# EAGLE design CEAZA SNOW SCALE V1.3 (EAGLE 9.6.2)
CEAZA
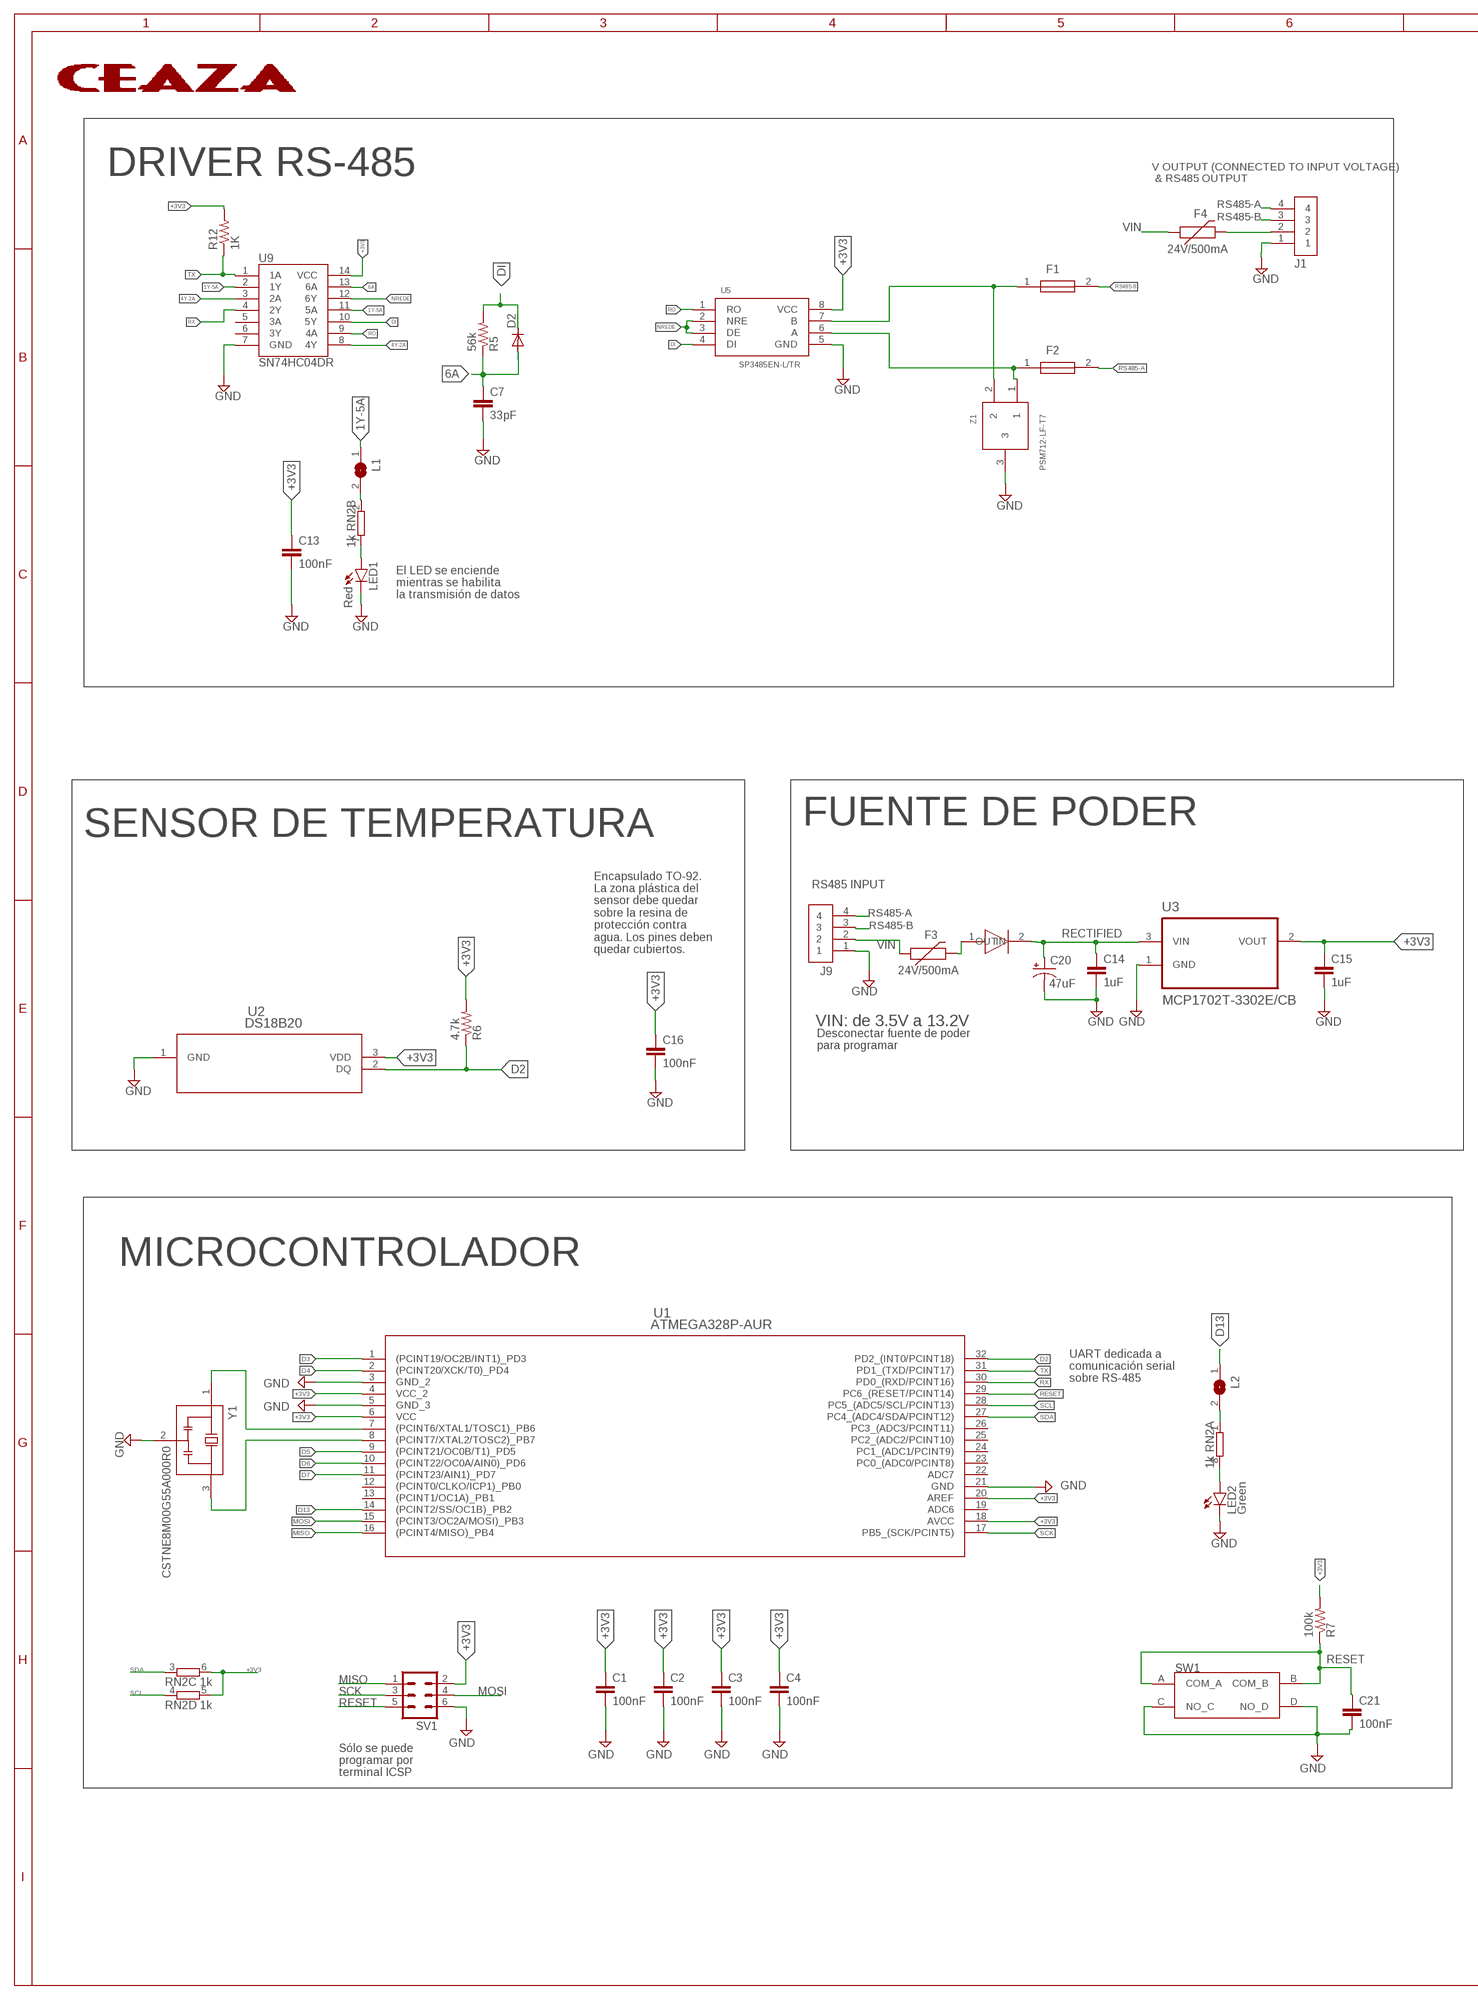
[diagram p0: schematic, sheet 1, part 1 of 2]
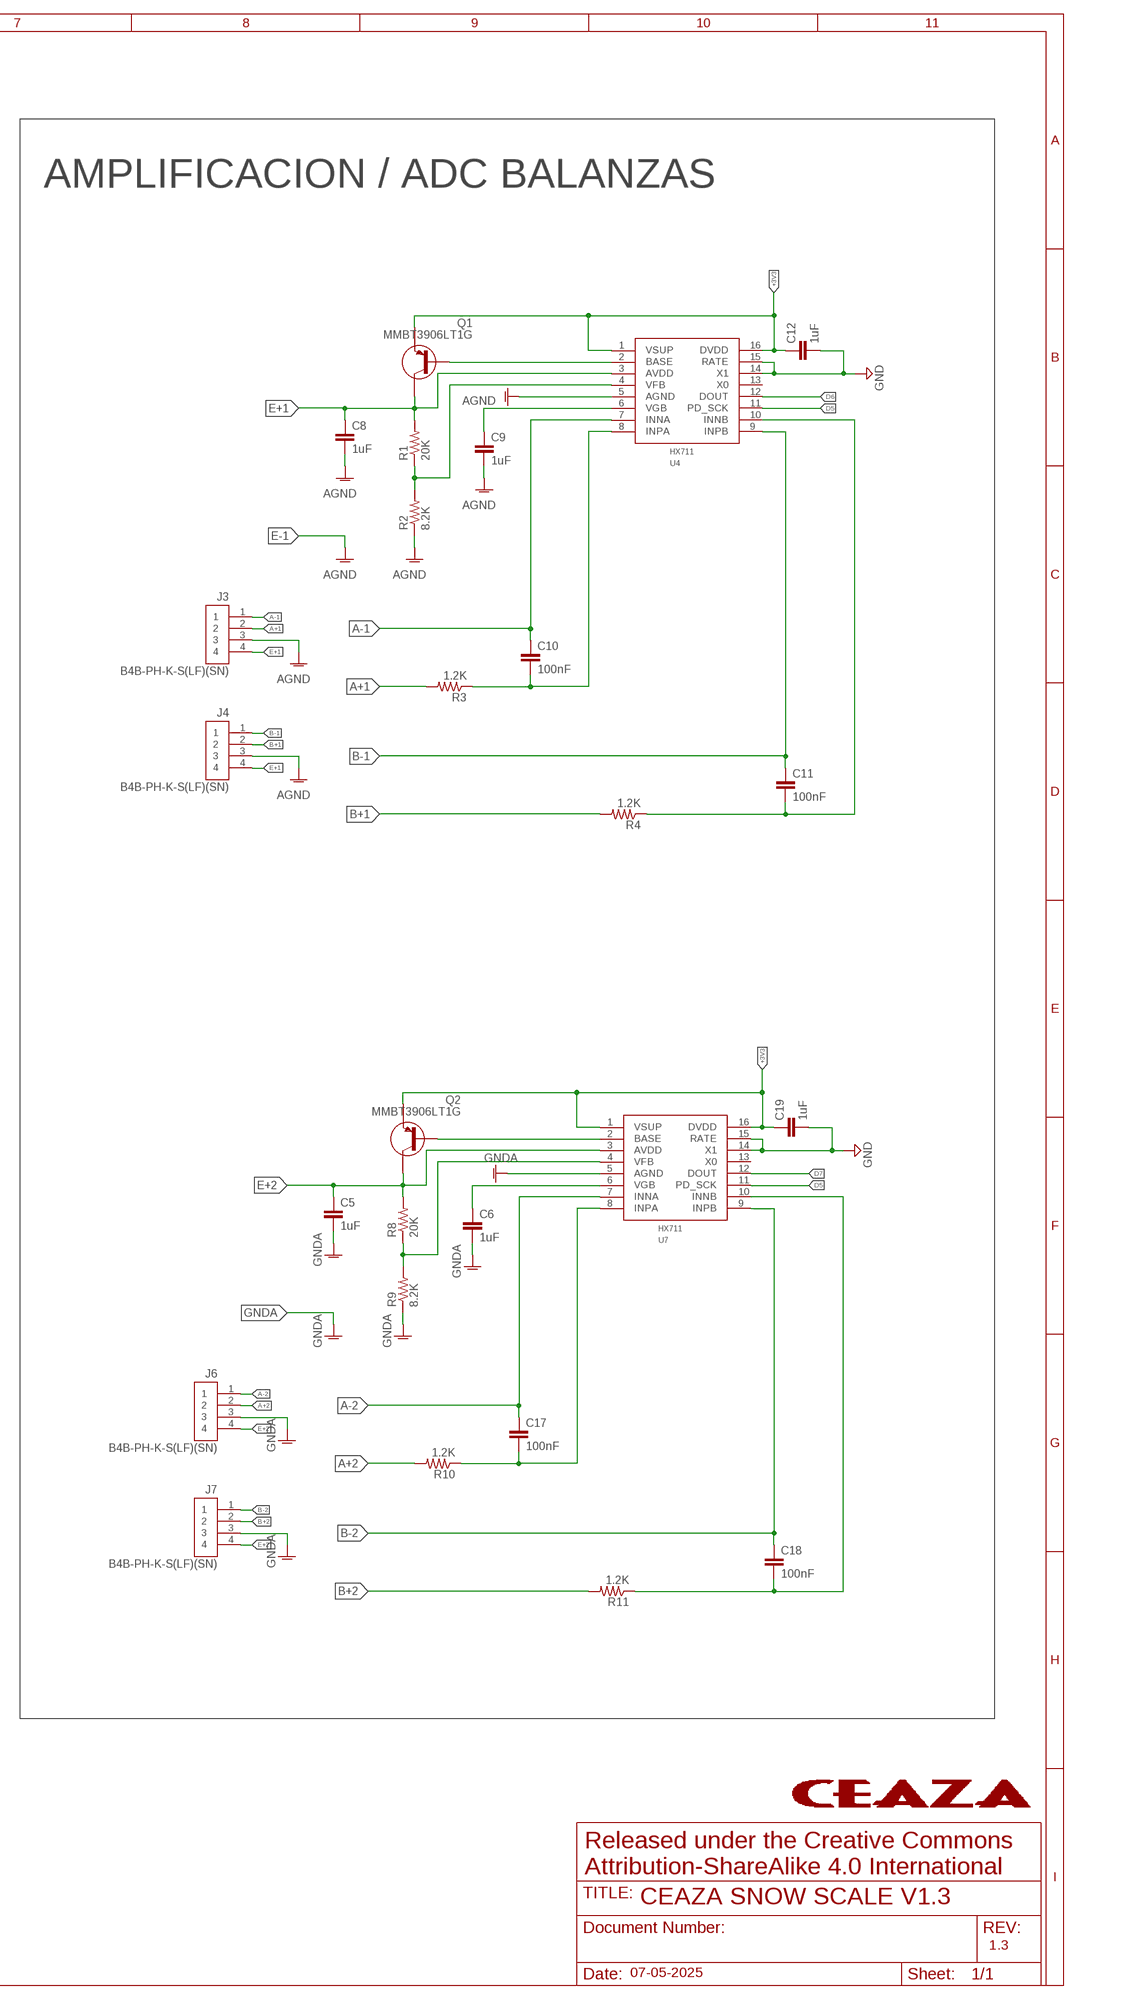
[diagram p1: schematic, sheet 1, part 2 of 2]

## Parts
C1  100nF  C-EUC0603K  [C0603K]
C2  100nF  C-EUC0603K  [C0603K]
C3  100nF  C-EUC0603K  [C0603K]
C4  100nF  C-EUC0603K  [C0603K]
C5  1uF  C-EUC0603K  [C0603K]
C6  1uF  C-EUC0603K  [C0603K]
C7  33pF  C-EUC0603K  [C0603K]
C8  1uF  C-EUC0603K  [C0603K]
C9  1uF  C-EUC0603K  [C0603K]
C10  100nF  C-EUC0603K  [C0603K]
C11  100nF  C-EUC0603K  [C0603K]
C12  1uF  C-EUC0603K  [C0603K]
C13  100nF  C-EUC0603K  [C0603K]
C14  1uF  C-EUC0603K  [C0603K]
C15  1uF  C-EUC0603K  [C0603K]
C16  100nF  C-EUC0603K  [C0603K]
C17  100nF  C-EUC0603K  [C0603K]
C18  100nF  C-EUC0603K  [C0603K]
C19  1uF  C-EUC0603K  [C0603K]
C20  47uF  CPOL-US153CLV-0605  [153CLV-0605]
C21  100nF  C-EUC0603K  [C0603K]
D1  SMA-SS34  [SMA-SS34]
D2  DIODE-SOD323-R  [SOD323-R]
F1  0805L010_24YR  [FUSC2114X100N]
F2  0805L010_24YR  [FUSC2114X100N]
F3  24V/500mA  PPTC_16V_2.5A  [1812]
F4  24V/500mA  PPTC_16V_2.5A  [1812]
J1  B4B-PH-K-S(LF)(SN)  [JST_B4B-PH-K-S(LF)(SN)]
J3  B4B-PH-K-S(LF)(SN)  [JST_B4B-PH-K-S(LF)(SN)]
J4  B4B-PH-K-S(LF)(SN)  [JST_B4B-PH-K-S(LF)(SN)]
J6  B4B-PH-K-S(LF)(SN)  [JST_B4B-PH-K-S(LF)(SN)]
J7  B4B-PH-K-S(LF)(SN)  [JST_B4B-PH-K-S(LF)(SN)]
J9  B4B-PH-K-S(LF)(SN)  [JST_B4B-PH-K-S(LF)(SN)]
L1  SJ  [SJ]
L2  SJ  [SJ]
LED1  Red  LEDCHIP-LED0805  [CHIP-LED0805]
LED2  Green  LEDCHIP-LED0805  [CHIP-LED0805]
Q1  MMBT3906LT1G  [SOT23]
Q2  MMBT3906LT1G  [SOT23]
R1  20K  R-US_R0603  [R0603]
R2  8.2K  R-US_R0603  [R0603]
R3  1.2K  R-US_R0603  [R0603]
R4  1.2K  R-US_R0603  [R0603]
R5  56k  R-US_R0603  [R0603]
R6  4.7k  R-US_R0603  [R0603]
R7  100k  R-US_R0603  [R0603]
R8  20K  R-US_R0603  [R0603]
R9  8.2K  R-US_R0603  [R0603]
R10  1.2K  R-US_R0603  [R0603]
R11  1.2K  R-US_R0603  [R0603]
R12  1K  R-US_R0603  [R0603]
RN2  1k  4R-N0603-ARV  [0603-ARV]
SV1  MA03-2  [MA03-2]
SW1  SW_KH-6X6X5H-STM  [SW_KH-6X6X5H-STM]
U1  ATMEGA328P-AUR  [32A]
U2  DS18B20  [21-0248A_MXM]
U3  MCP1702T-3302E/CB  [SOT95P255X145-3N]
U4  HX711  [HX711]
U5  SP3485EN-L/TR  [SP3485EN-L/TR]
U7  HX711  [HX711]
U9  SN74HC04DR  [SOIC127P600X175-14N]
Y1  CSTNE8M00G55A000R0  [OSC_CSTNE8M00G55A000R0]
Z1  PSM712-LF-T7  [SOT23]

## Nets
1Y-5A: L1.1 U9.2(1Y) U9.11(5A)
4Y-2A: U9.3(2A) U9.8(4Y)
6A: C7.1 D2.A R5.1 U9.13(6A)
+3V3: C1.1 C2.1 C3.1 C4.1 C12.1 C13.1 C15.1 C16.1 C19.1 Q1.2(E) Q2.2(E) R6.2 R7.2 R12.2 RN2.5 RN2.6 SV1.2 U1.4(VCC_2) U1.6(VCC) U1.18(AVCC) U1.20(AREF) U2.3(VDD) U3.2(VOUT) U4.1(VSUP) U4.16(DVDD) U5.8(VCC) U7.1(VSUP) U7.16(DVDD) U9.14(VCC)
A+1: J3.2 R3.2
A+2: J6.2 R10.2
A-1: C10.1 J3.1 U4.7(INNA)
A-2: C17.1 J6.1 U7.7(INNA)
AGND: C8.2 C9.2 J3.3 J4.3 R2.1 U4.5(AGND)
B+1: J4.2 R4.2
B+2: J7.2 R11.2
B-1: C11.1 J4.1 U4.9(INPB)
B-2: C18.1 J7.1 U7.9(INPB)
D2: R6.1 U1.32(PD2_(INT0/PCINT18)) U2.2(DQ)
D3: U1.1((PCINT19/OC2B/INT1)_PD3)
D4: U1.2((PCINT20/XCK/T0)_PD4)
D5: U1.9((PCINT21/OC0B/T1)_PD5) U4.11(PD_SCK) U7.11(PD_SCK)
D6: U1.10((PCINT22/OC0A/AIN0)_PD6) U4.12(DOUT)
D7: U1.11((PCINT23/AIN1)_PD7) U7.12(DOUT)
D13: L2.1 U1.14((PCINT2/SS/OC1B)_PB2)
DI: D2.C R5.2 U5.4(DI) U9.10(5Y)
E+1: C8.1 J3.4 J4.4 Q1.3(C) R1.2 U4.3(AVDD)
E+2: C5.1 J6.4 J7.4 Q2.3(C) R8.2 U7.3(AVDD)
GND: C1.2 C2.2 C3.2 C4.2 C7.2 C12.2 C13.2 C14.2 C15.2 C16.2 C19.2 C20.- C21.2 J1.1 J9.1 LED1.C LED2.C SV1.6 SW1.C(NO_C) SW1.D(NO_D) U1.3(GND_2) U1.5(GND_3) U1.21(GND) U2.1(GND) U3.1(GND) U4.14(X1) U4.15(RATE) U5.5(GND) U7.14(X1) U7.15(RATE) U9.7(GND) Y1.2(GND) Z1.3
GNDA: C5.2 C6.2 J6.3 J7.3 R9.1 U7.5(AGND)
MISO: SV1.1 U1.16((PCINT4/MISO)_PB4)
MOSI: SV1.4 U1.15((PCINT3/OC2A/MOSI)_PB3)
N$1: F2.1 U5.6(A) Z1.1
N$2: Q1.1(B) U4.2(BASE)
N$3: LED1.A RN2.7
N$4: C9.1 U4.6(VGB)
N$5: R1.1 R2.2 U4.4(VFB)
N$6: Q2.1(B) U7.2(BASE)
N$7: C10.2 R3.1 U4.8(INPA)
N$8: C11.2 R4.1 U4.10(INNB)
N$9: R8.1 R9.2 U7.4(VFB)
N$10: U1.7((PCINT6/XTAL1/TOSC1)_PB6) Y1.1(IN)
N$11: U1.8((PCINT7/XTAL2/TOSC2)_PB7) Y1.3(OUT)
N$12: LED2.A RN2.8
N$13: C6.1 U7.6(VGB)
N$14: C17.2 R10.1 U7.8(INPA)
N$15: C18.2 R11.1 U7.10(INNB)
N$16: F1.1 U5.7(B) Z1.2
N$17: F4.2 J1.2
N$18: D1.1(IN) F3.2
N$19: L1.2 RN2.2
N$20: L2.2 RN2.1
NREDE: U5.2(NRE) U5.3(DE) U9.12(6Y)
RECTIFIED: C14.1 C20.+ D1.2(OUT) U3.3(VIN)
RESET: C21.1 R7.1 SV1.5 SW1.A(COM_A) SW1.B(COM_B) U1.29(PC6_(RESET/PCINT14))
RO: U5.1(RO) U9.9(4A)
RS485-A: F2.2 J1.4 J9.4
RS485-B: F1.2 J1.3 J9.3
RX: U1.30(PD0_(RXD/PCINT16)) U9.4(2Y)
SCK: SV1.3 U1.17(PB5_(SCK/PCINT5))
SCL: RN2.4 U1.28(PC5_(ADC5/SCL/PCINT13))
SDA: RN2.3 U1.27(PC4_(ADC4/SDA/PCINT12))
TX: R12.1 U1.31(PD1_(TXD/PCINT17)) U9.1(1A)
VIN: F3.1 F4.1 J9.2
Unconnected: U1.12((PCINT0/CLKO/ICP1)_PB0) U1.13((PCINT1/OC1A)_PB1) U1.19(ADC6) U1.22(ADC7) U1.23(PC0_(ADC0/PCINT8)) U1.24(PC1_(ADC1/PCINT9)) U1.25(PC2_(ADC2/PCINT10)) U1.26(PC3_(ADC3/PCINT11)) U4.13(X0) U7.13(X0) U9.5(3A) U9.6(3Y)

## Notes on the sheet
- DRIVER RS-485
- V OUTPUT (CONNECTED TO INPUT VOLTAGE)
   & RS485 OUTPUT
- AMPLIFICACION / ADC BALANZAS
- El LED se enciende
  mientras se habilita
  la transmisión de datos
- SENSOR DE TEMPERATURA | FUENTE DE PODER
- RS485 INPUT
- Encapsulado TO-92. 
  La zona plástica del 
  sensor debe quedar 
  sobre la resina de 
  protección contra 
  agua. Los pines deben
  quedar cubiertos.
- VIN: de 3.5V a 13.2V
- Desconectar fuente de poder
  para programar
- MICROCONTROLADOR
- UART dedicada a
  comunicación serial
  sobre RS-485
- Sólo se puede 
  programar por
  terminal ICSP
- Released under the Creative Commons
  Attribution-ShareAlike 4.0 International
- 1.3
- 07-05-2025
- C:/Users/adria/OneDrive/Imágenes/CEAZA_NOMBRE_COLOR.bmp

## Library data of the parts
C1-C19 C21 = rcl:C-EU: CAPACITOR, European symbol; SPICEPREFIX: C
C20 = rcl:CPOL-US: POLARIZED CAPACITOR, American symbol; SPICEPREFIX: C
D1 = SMA-SS34:SMA-SS34
D2 = diode:DIODE-: DIODE
F1 F2 = 0805L010_24YR:0805L010_24YR: LITTELFUSE - 0805L010/24YR - Resettable Fuse, PPTC, 0805 (2012 Metric), POLY-FUSE 0805L Series, 24 VDC, 100 mA, 300 mA, 1.5 s Source: Datasheet <https://4donline.ihs.com/images/VipMasterIC/IC/LFSI/LFSI-S-A0008594415/LFSI-S-A0008594415-1.pdf?hkey=6D3A4C79FDBF58556ACFDE234799DDF0>; DESCRIPTION: LITTELFUSE - 0805L010/24YR - Resettable Fuse, PPTC, 0805 (2012 Metric), POLY-FUSE 0805L Series, 24 VDC, 100 mA, 300 mA, 1.5 s; HEIGHT: 1mm; MANUFACTURER_NAME: LITTELFUSE; MANUFACTURER_PART_NUMBER: 0805L010/24YR; MOUSER_PART_NUMBER: 576-0805L010/24YR; MOUSER_PRICE-STOCK: https://www.mouser.co.uk/ProductDetail/Littelfuse/0805L010-24YR?qs=cIziFXvMxOWw%2F8NcVv01xw%3D%3D
F3 F4 = SparkFun-Fuses:PPTC: Resettable Fuse PPTC Resettable Fuse. Really a sort of resistor with a polymeric positive temperature coefficient whose resistance increases dramatically with an increase in temperature. When heated by the power passing through the resistance rises causing the current to be limited, protecting the circuit. This is achieved by the transition of the polymer from a crystalline to an amorphous state where the conductive carbon separates breaking the conductive pathways found in the cool crystalline structure. When a PPTC cools back down it resumes conducting letting the circuit turn back on. SparkFun Products: SparkFun RedBoard - Programmed with Arduino <https://www.sparkfun.com/products/12757> Pro Micro - 5V/16MHz <https://www.sparkfun.com/products/12640> Arduino Pro 328 - 5V/16MHz <https://www.sparkfun.com/products/10915> MP3 Trigger <https://www.sparkfun.com/products/13720>; PROD_ID: RES-14390; VALUE: 16V/2.5A(5A TRIP)
J1 J3 J4 J6 J7 J9 = B4B-PH-K-S_LF__SN_:B4B-PH-K-S(LF)(SN): PH Series 4 Position 2 mm Pitch Through Hole Crimp Top Entry Shrouded Header; ARROW_ELECTRONICS-PURCHASE-URL: https://snapeda.com/shop?store=Arrow+Electronics&id=422410; AVAILABILITY: Unavailable; DESCRIPTION: Connector Header Through Hole 4 position 0.079 (2.00mm); MF: JST Sales; MP: B4B-PH-K-S(LF)(SN); PACKAGE: None; PRICE: None
L1 L2 = jumper:SJ: SMD solder JUMPER
LED1 LED2 = led:LED: LED OSRAM: - CHIPLED LG R971, LG N971, LY N971, LG Q971, LY Q971, LO R971, LY R971 LH N974, LH R974 LS Q976, LO Q976, LY Q976 LO Q996 - Hyper CHIPLED LW Q18S LB Q993, LB Q99A, LB R99A - SideLED LS A670, LO A670, LY A670, LG A670, LP A670 LB A673, LV A673, LT A673, LW A673 LH A674 LY A675 LS A676, LA A676, LO A676, LY A676, LW A676 LS A679, LY A679, LG A679 - Hyper Micro SIDELED® LS Y876, LA Y876, LO Y876, LY Y876 LT Y87S - SmartLED LW L88C, LW L88S LB L89C, LB L89S, LG L890 LS L89K, LO L89K, LY L89K LS L896, LA L896, LO L896, LY L896 - TOPLED LS T670, LO T670, LY T670, LG T670, LP T670 LSG T670, LSP T670, LSY T670, LOP T670, LYG T670 LG T671, LOG T671, LSG T671 LB T673, LV T673, LT T673, LW T673 LH T674 LS T676, LA T676, LO T676, LY T676, LB T676, LH T676, LSB T676, LW T676 LB T67C, LV T67C, LT T67C, LS T67K, LO T67K, LY T67K, LW E67C LS E67B, LA E67B, LO E67B, LY E67B, LB E67C, LV E67C, LT E67C LW T67C LS T679, LY T679, LG T679 LS T770, LO T770, LY T770, LG T770, LP T770 LB T773, LV T773, LT T773, LW T773 LH T774 LS E675, LA E675, LY E675, LS T675 LS T776, LA T776, LO T776, LY T776, LB T776 LHGB T686 LT T68C, LB T68C - Hyper Mini TOPLED® LB M676 - Mini TOPLED Santana® LG M470 LS M47K, LO M47K, LY M47K Source: http://www.osram.convergy.de LUXEON: - LUMILED® LXK2-PW12-R00, LXK2-PW12-S00, LXK2-PW14-U00, LXK2-PW14-V00 LXK2-PM12-R00, LXK2-PM12-S00, LXK2-PM14-U00 LXK2-PE12-Q00, LXK2-PE12-R00, LXK2-PE12-S00, LXK2-PE14-T00, LXK2-PE14-U00 LXK2-PB12-K00, LXK2-PB12-L00, LXK2-PB12-M00, LXK2-PB14-N00, LXK2-PB14-P00, LXK2-PB14-Q00 LXK2-PR12-L00, LXK2-PR12-M00, LXK2-PR14-Q00, LXK2-PR14-R00 LXK2-PD12-Q00, LXK2-PD12-R00, LXK2-PD12-S00 LXK2-PH12-R00, LXK2-PH12-S00 LXK2-PL12-P00, LXK2-PL12-Q00, LXK2-PL12-R00 Source: www.luxeon.com KINGBRIGHT: KA-3528ASYC Source: www.kingbright.com
Q1 Q2 = MMBT3906LT1G:MMBT3906LT1G: http://octopart.com/mmbt3906lt1g.-on+semiconductor-8986246; AVAILABILITY: Unavailable; DESCRIPTION: Bipolar _BJT_ Transistor PNP 40V 200mA 250MHz 300mW Surface Mount SOT-23-3 _TO-236_; MF: ON Semiconductor; MP: MMBT3906LT1G; PACKAGE: SOT-23-3 Motorola; PRICE: None
R1-R12 = rcl:R-US_: RESISTOR, American symbol; SPICEPREFIX: R
RN2 = resistor-dil:4R-N: Array Chip Resistor Source: RS Component / Phycomp; OC_FARNELL: unknown; OC_NEWARK: unknown
SV1 = con-lstb:MA03-2: PIN HEADER; OC_FARNELL: unknown; OC_NEWARK: unknown
SW1 = SW_KH-6X6X5H-STM:SW_KH-6X6X5H-STM
U1 = ATMEGA328P-AUR:ATMEGA328P-AUR; BUILT_BY: EMA_UL_Team; MANUFACTURER_PART_NUMBER: ATMEGA328P-AUR; VENDOR: Atmel
U2 = DS18B20:DS18B20; BUILT_BY: EMA_UL_Team; MANUFACTURER_PART_NUMBER: DS18B20; SOURCELIBRARY: Maxim_2011-05-13; VENDOR: Maxim Integrated Products
U3 = MCP1702T-3302E_CB:MCP1702T-3302E/CB: 250 mA Low Quiescent Current LDO Regulator Check prices <https://snapeda.com/parts/MCP1702T-3302E/CB/Microchip/view-part/?ref=eda>; ARROW_ELECTRONICS-PURCHASE-URL: https://snapeda.com/shop?store=Arrow+Electronics&id=44686; AVAILABILITY: Good; DESCRIPTION: Linear Voltage Regulator IC 1 Output 250mA SOT-23A-3; DIGIKEY-PURCHASE-URL: https://snapeda.com/shop?store=DigiKey&id=44686; MF: Microchip; MOUSER-PURCHASE-URL: https://snapeda.com/shop?store=Mouser&id=44686; MP: MCP1702T-3302E/CB; PACKAGE: SOT-23-3 Microchip; PRICE: None
U4 U7 = HX711:HX711
U5 = SP3485EN-L TR:SP3485EN-L/TR
U9 = SN74HC04DR:SN74HC04DR: SN74HC04DR, Hex Inverter 5.2mA 2 ??? 6 V 14-Pin SOIC Source: Datasheet <http://www.ti.com/lit/ds/symlink/sn74hc04.pdf>; DESCRIPTION: SN74HC04DR, Hex Inverter 5.2mA 2 ??? 6 V 14-Pin SOIC; HEIGHT: 1.75mm; MANUFACTURER_NAME: Texas Instruments; MANUFACTURER_PART_NUMBER: SN74HC04DR; MOUSER_PART_NUMBER: 595-SN74HC04DR; MOUSER_PRICE-STOCK: https://www.mouser.co.uk/ProductDetail/Texas-Instruments/SN74HC04DR?qs=5BZzbFV4k2tw1CBjnu%2F%252B9Q%3D%3D
Y1 = CSTNE8M00G55A000R0:CSTNE8M00G55A000R0: 8MHz Ceramic Resonator Built in Capacitor 33pF ±0.13% 40 Ohms -40°C ~ 125°C Surface Mount Check prices <https://pricing.snapeda.com/parts/CSTNE8M00G55A000R0/Murata%20Electronics%20North%20America/view-part?ref=eda>; AVAILABILITY: Warning; DESCRIPTION: 8MHz Ceramic Resonator Built in Capacitor 33pF ±0.2% 40 Ohms -40°C ~ 125°C Surface Mount; MF: Murata Electronics North America; MP: CSTNE8M00G55A000R0; PACKAGE: SMD-3 Murata; PRICE: None; PURCHASE-URL: https://pricing.snapeda.com/search/part/CSTNE8M00G55A000R0/?ref=eda
Z1 = PSM712-LF-T7:PSM712-LF-T7

## Board
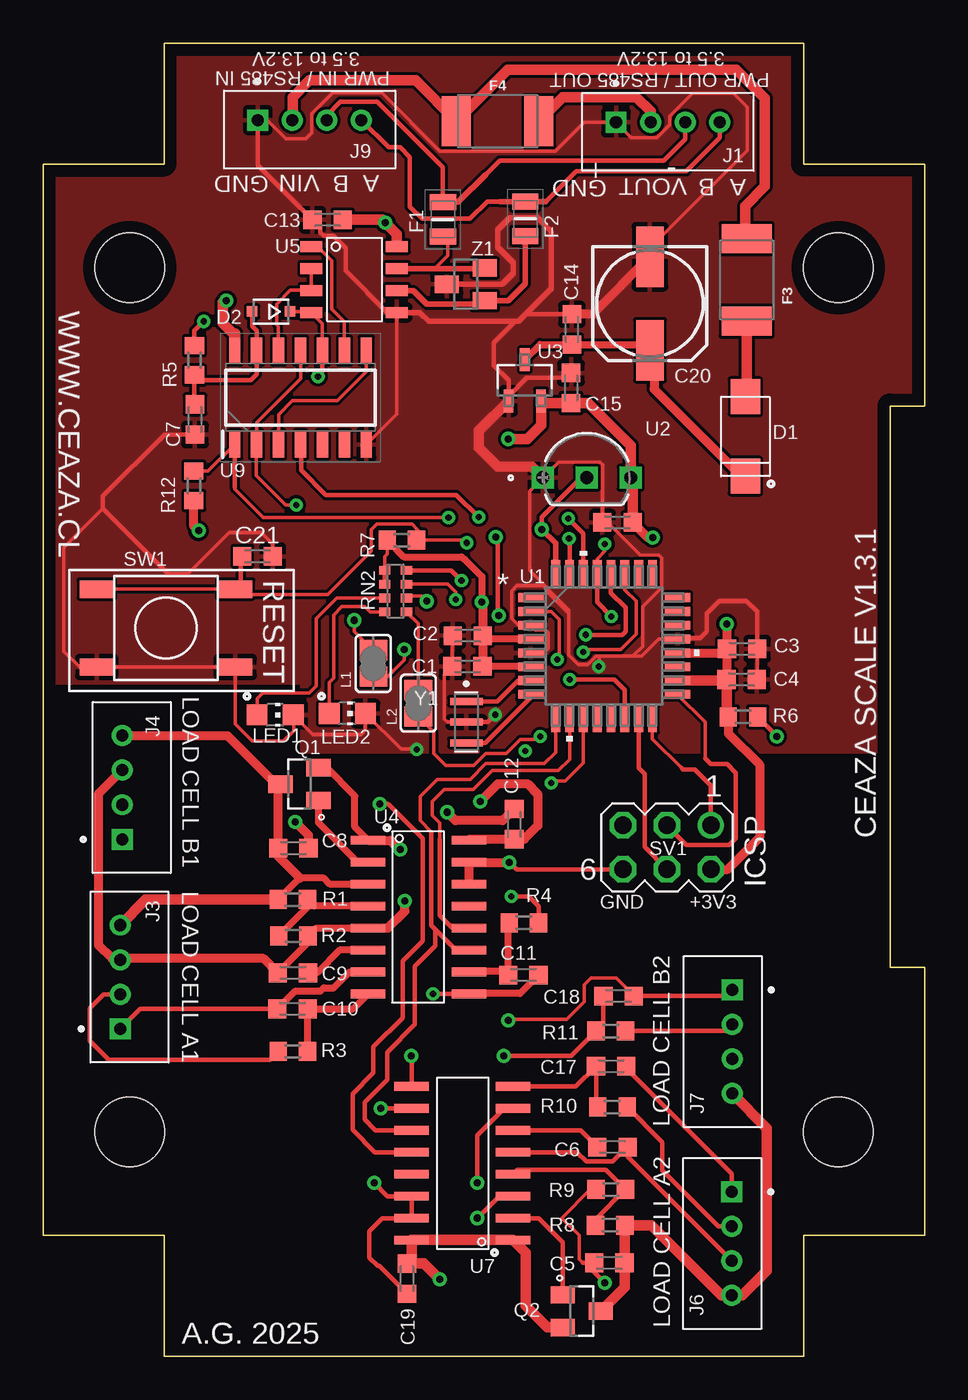
[diagram p2: board, top side]
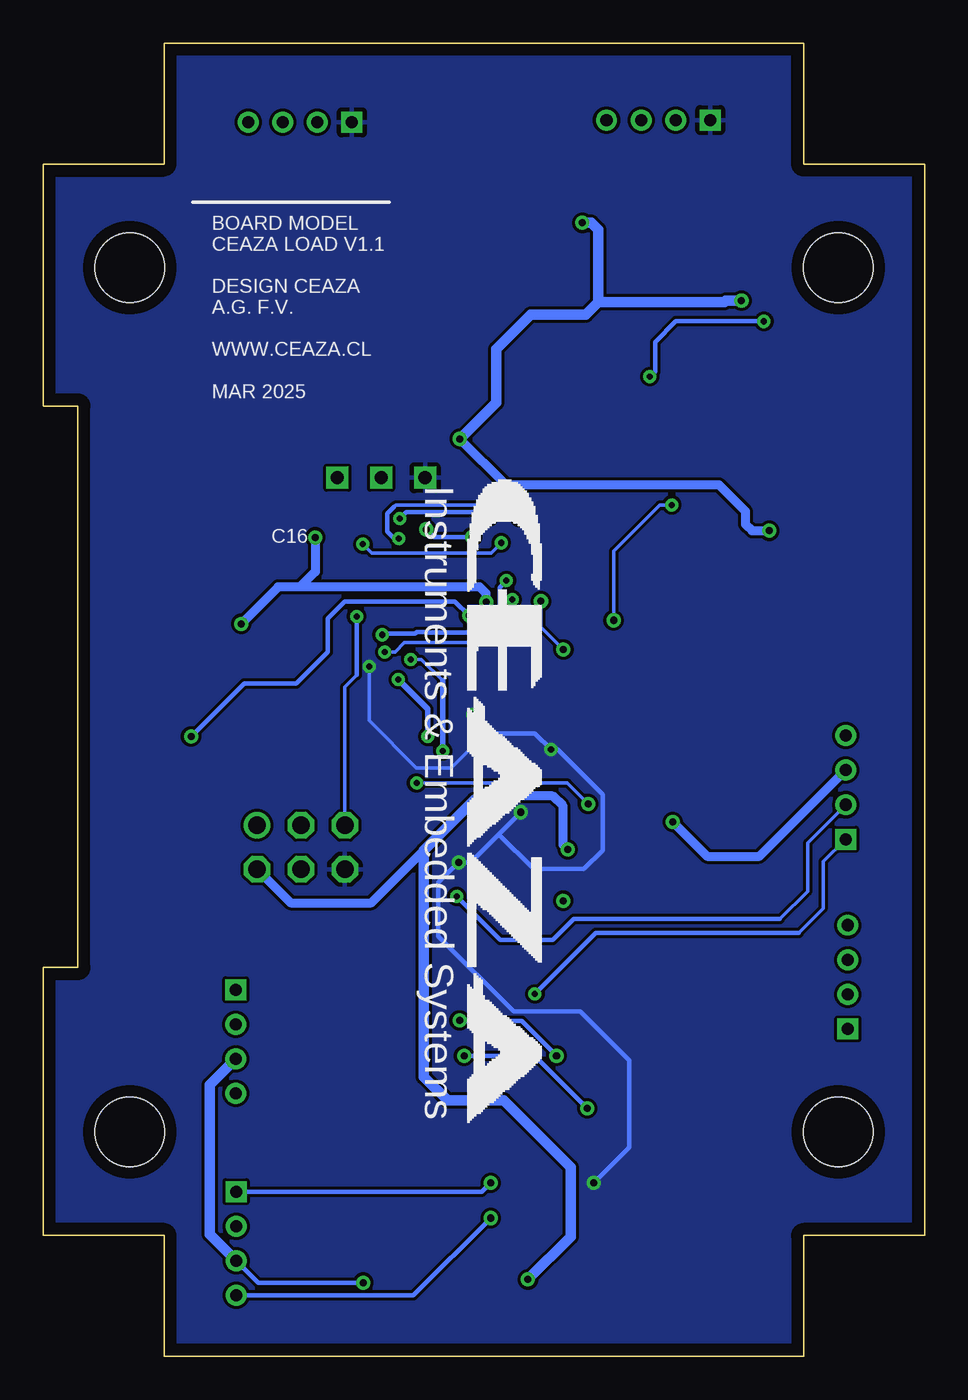
[diagram p3: board, bottom side, seen from below]

Size 51 x 76 mm. Coordinates in mm from the lower left corner, seen from the top.
Outline: 0,7 7,7 7,0 44,0 44,7 51,7 51,22.5 49,22.5 49,55 51,55 51,69 44,69 44,76 7,76 7,69 0,69 0,7
Copper layers (1*16): Top 0.035mm / dielectric 1.5mm / Bottom 0.035mm
Design rules "default": minimum track width 8mil, minimum drill 16mil, track to track 7mil, track to pad 7mil, pad to pad 8mil, via to via 10mil, smd to smd 7mil, copper to edge 27mil, drill to drill 12mil, minimum pad ring 10mil, minimum via ring 8mil, stop-mask expansion 2mil, vias tented up to drill 24mil, thermal gap 10mil
Holes 4 mm at 5,13 46,13 5,63 46,63

### Footprints (pad centres in the part's own frame; a part is rotated, then mirrored left to right if it is on the bottom)
C0603K = smd 1.05 x 1.08: 1 -0.875,0; 2 0.875,0
153CLV-0605 = smd 3.5 x 1.6: + 2.7,0; - -2.7,0
SMA-SS34 = smd 2 x 1.7: 1 0,-1.4; 2 4.6,-1.4
SOD323-R = smd 0.6 x 0.6: A 1.1,0; C -1.1,0
FUSC2114X100N = smd 0.93 x 1.52: 1 -1,0; 2 1,0
1812 = smd 1.676 x 2.896: 1 -2.388,0; 2 2.388,0
JST_B4B-PH-K-S(LF)(SN) = drill 0.7 square: 1 3,-0.55 | drill 0.7: 2 1,-0.55; 3 -1,-0.55; 4 -3,-0.55
SJ = smd 1.168 x 1.6: 1 -0.762,0; 2 0.762,0
CHIP-LED0805 = smd 1.2 x 1.2: A 0,-1.05; C 0,1.05
SOT23 = smd 1.4 x 1: 1 -1.1,0.95; 2 -1.1,-0.95; 3 1.1,0
R0603 = smd 1 x 1.1: 1 -0.85,0; 2 0.85,0
0603-ARV = smd 0.5 x 0.65: 1 -1.2,-0.625; 2 -0.4,-0.625; 3 0.4,-0.625; 4 1.2,-0.625; 5 1.2,0.625; 6 0.4,0.625; 7 -0.4,0.625; 8 -1.2,0.625
MA03-2 = drill 1.016: 1 -2.54,-1.27 | drill 1.016 octagon: 2 -2.54,1.27; 3 0,-1.27; 4 0,1.27; 5 2.54,-1.27; 6 2.54,1.27
SW_KH-6X6X5H-STM = smd 2 x 1: A 1,5; B 9,5; C 1,0.5; D 9,0.5
32A = smd 1.473 x 0.508: 1 -4.242,2.8; 2 -4.242,2; 3 -4.242,1.2; 4 -4.242,0.4; 5 -4.242,-0.4; 6 -4.242,-1.2; 7 -4.242,-2; 8 -4.242,-2.8; 17 4.242,-2.8; 18 4.242,-2; 19 4.242,-1.2; 20 4.242,-0.4; 21 4.242,0.4; 22 4.242,1.2; 23 4.242,2; 24 4.242,2.8 | smd 0.508 x 1.473: 9 -2.8,-4.242; 10 -2,-4.242; 11 -1.2,-4.242; 12 -0.4,-4.242; 13 0.4,-4.242; 14 1.2,-4.242; 15 2,-4.242; 16 2.8,-4.242; 25 2.8,4.242; 26 2,4.242; 27 1.2,4.242; 28 0.4,4.242; 29 -0.4,4.242; 30 -1.2,4.242; 31 -2,4.242; 32 -2.8,4.242
21-0248A_MXM = drill 0.762 pad 1.27 square: 1 0,0; 2 2.54,0; 3 5.08,0
SOT95P255X145-3N = smd 0.559 x 1.321: 1 -0.94,-1.194; 2 0.94,-1.194; 3 0,1.194
HX711 = smd 2 x 0.5: 1 -2.54,3.81; 2 -2.54,2.54; 3 -2.54,1.27; 4 -2.54,0; 5 -2.54,-1.27; 6 -2.54,-2.54; 7 -2.54,-3.81; 8 -2.54,-5.08; 9 3.31,-5.08; 10 3.31,-3.81; 11 3.31,-2.54; 12 3.31,-1.27; 13 3.31,0; 14 3.31,1.27; 15 3.31,2.54; 16 3.31,3.81
SP3485EN-L/TR = smd 1.27 x 0.635: 1 -2.5,1.91; 2 -2.5,0.64; 3 -2.5,-0.63; 4 -2.5,-1.9; 5 2.45,-1.9; 6 2.45,-0.63; 7 2.45,0.64; 8 2.45,1.91
SOIC127P600X175-14N = smd 1.525 x 0.65: 1 -2.712,3.81; 2 -2.712,2.54; 3 -2.712,1.27; 4 -2.712,0; 5 -2.712,-1.27; 6 -2.712,-2.54; 7 -2.712,-3.81; 8 2.712,-3.81; 9 2.712,-2.54; 10 2.712,-1.27; 11 2.712,0; 12 2.712,1.27; 13 2.712,2.54; 14 2.712,3.81
OSC_CSTNE8M00G55A000R0 = smd 0.4 x 1.9: 1 -1.2,0; 2 0,0; 3 1.2,0
SOT23' = smd 1 x 1.4: 1 -0.95,-1.1; 2 0.95,-1.1; 3 0,1.1

### Placement (x,y rotation side)
C1  24.54,39.93 180 top
C2  24.56,41.71 180 top
C3  40.44,40.95 0 top
C4  40.41,39.17 0 top
C5  32.76,5.41 180 top
C6  32.94,12.12 0 top
C7  8.78,54.22 270 top
C8  14.47,29.41 0 top
C9  14.45,22.19 180 top
C10  14.42,20.11 0 top
C11  27.78,22.07 180 top
C12  27.25,30.8 90 top
C13  16.45,65.78 180 top
C14  30.59,59.44 90 top
C15  30.54,56.04 90 top
C16  33.22,48.26 180 top
C17  32.86,16.79 180 top
C18  33.29,20.85 180 top
C19  21.05,4.5 270 top
C20  35.1,60.93 270 top
C21  12.4,46.3 0 top
D1  42.02,55.54 270 top
D2  13.19,60.47 180 top
F1  23.13,65.8 90 top
F2  27.9,65.83 90 top
F3  40.7,62.3 270 top
F4  26.29,71.49 0 top
J1  36.14,70.87 180 top
J3  5,21.95 270 top
J4  5.12,32.92 270 top
J6  39.29,6.53 90 top
J7  39.31,18.21 90 top
J9  15.41,71 180 top
L1  19.1,40.1 270 top
L2  21.7,37.8 90 top
LED1  13.42,37.13 270 top
LED2  17.6,37.21 270 top
Q1  14.83,33.12 180 top
Q2  31.16,2.62 0 top
R1  14.45,26.44 180 top
R2  14.47,24.33 180 top
R3  14.45,17.65 180 top
R4  27.81,25.09 0 top
R5  8.75,57.65 90 top
R6  40.49,37.01 180 top
R7  20.75,47.23 180 top
R8  32.81,7.59 0 top
R9  32.83,9.65 0 top
R10  32.94,14.43 0 top
R11  32.83,18.82 0 top
R12  8.72,50.38 270 top
RN2  20.39,44.28 90 top
SV1  36.08,29.46 180 top
SW1  2.1,39.4 0 top
U1  32.45,41.11 0 top
U2  28.91,50.85 0 top
U3  27.86,56.49 0 top
U4  21.33,26.05 0 top
U5  18.01,62.32 0 top
U7  24.63,10.54 180 top
U9  14.89,55.49 90 top
Y1  24.49,36.7 270 top
Z1  PSM712-LF-T7  [SOT23']  24.44,62.04 90 top

### Tracks (layer width: path | path; a pad name or v marks a point on that pad's centre or on a via)
1Y-5A  (via drill 0.35, 0.41)
  Top 0.203: U9.11 14.9,58.19 14.9,56.6 12.35,54.05 U9.2 12.33,52.76 12.33,50.97 14.02,49.28 v14.64,49.28 | L1.1 18,41.96 v18,42.6
  Bottom 0.203: v14.64,49.28 15.32,49.28 18,46.6 v18,42.6
4Y-2A
  Top 0.203: U9.8 18.7,57 17,55.3 14.4,55.3 13.62,54.52 U9.3
6A
  Top 0.254: D2.A 12.09,59.62 12.35,59.35 U9.13 12.35,56.85 12,56.5 9.05,56.5 R5.1 8.75,55.12 C7.1
+3V3  (via drill 0.41)
  Top 0.203: R7.2 19.9,46.43 19.75,46.28 19.75,45.5 RN2.5
  Top 0.254: RN2.6 RN2.5
  Top 0.406: U1.4 25.63,41.51 | 25.63,41.51 C2.1 | U1.6 25.43,39.91 C1.1 25.41,41.29 25.63,41.51 | U4.1 18.03,30.63 18.03,32.43 16.39,34.07 Q1.2 | R7.2 20.86,46.27 24.21,46.27 24.35,46.13 24.39,46.13 25.38,45.15 v25.38,43.66
  Top 0.508: 25.43,39.91 25.44,39.92 C2.1 25.44,43.59 v25.38,43.66 | U1.20 39.33,40.71 39.54,40.92 | v39.54,42.4 39.54,40.92 | C16.1 34.96,47.4 v35.26,47.4 | U4.16 24.71,29.93 C12.1 27.84,29.93 28.62,30.72 28.62,32.52 28,33.14 26.32,33.14 v25.29,32.11 | U4.1 20.11,29.86 v20.65,29.33 | v8.99,47.78 8.72,48.05 R12.2 | R6.2 39.64,36.06 41.45,34.25 41.45,30.02 39.62,28.19 SV1.2 | C3.1 39.54,40.92 | 39.54,40.92 C4.1
  Top 0.61: Q2.2 29.16,1.67 27.91,2.92 27.91,5.99 U7.1 U7.16 21.32,5.64 C19.1 22.03,5.37 v22.95,4.45 | 34,50.87 34,52.7 31.53,55.17 C15.1 28.93,55.17 U3.2 28.8,53.9 28,53.1 v26.9,53.1 | 34,50.87 U2.3 | C16.1 34.1,50.77 34,50.87 | v10.6,61.1 10.5,61 10.4,61 10.4,59.8 11,59.2 11.1,59.2 11.1,58.23 U9.14 | C13.1 19.62,65.78 v19.8,65.6 20.46,64.94 U5.8 | U1.18 39.48,39.11 C4.1 39.54,37.11 R6.2
  Bottom 0.508: v25.38,43.66 25.38,44.16 25.75,44.53 36.15,44.53 | 36.15,44.53 37.4,44.53 v39.54,42.4 | v35.26,47.4 35.26,45.42 36.15,44.53 | v20.65,29.33 20.93,29.61 20.93,31.85 21.51,32.43 24.97,32.43 v25.29,32.11 | v26.9,53.1 24.25,50.45 11.91,50.45 10.37,48.91 10.37,48.16 9.99,47.78 v8.99,47.78 | SV1.2 36.68,26.25 32.01,26.25 28.98,29.28
  Bottom 0.61: v22.95,4.45 20.48,6.92 20.48,10.92 24.36,14.8 27.6,14.8 28.98,16.18 28.98,29.28 26.05,32.21 25.39,32.21 v25.29,32.11 | v26.9,53.1 24.8,55.2 24.8,58.3 22.8,60.3 19.6,60.3 18.9,61 | 18.9,61 18.9,65.2 19.3,65.6 v19.8,65.6 | 18.9,61 11.6,61 11.5,61.1 v10.6,61.1
A+1
  Top 0.254: J3.2 3.5,20.95 2.68,20.13 2.68,18.27 3.8,17.15 13.1,17.15 R3.2
A+2
  Top 0.254: R10.2 35.82,12.39 35.82,10.76 39.05,7.53 J6.2
A-1
  Top 0.254: J3.1 5.61,20.11 C10.1
  Top 0.406: C10.1 14.58,21.15 16.05,21.15 16.23,21.33 16.81,21.33 17.73,22.25 U4.7
A-2  (via drill 0.41)
  Top 0.254: J6.1 39.84,10.55 33.73,16.65 C17.1 | U7.7 26.66,14.35 25.11,12.8 v25.11,10.03
  Bottom 0.254: v25.11,10.03 25.62,9.53 J6.1
AGND  (via drill 0.41)
  Top 0.254: 4.51,23.02 4.46,22.97 4.03,22.97 3.98,23.02
  Top 0.406: U4.5 15.78,24.79 R2.1 15.32,23.94 C9.2
  Top 0.508: C8.2 15.35,30.16 v14.58,30.93 | J4.3 3.19,32.55 3.19,23.81 3.98,23.02 | 4.46,22.97 J3.3 4.05,22.95 4.03,22.97 | C9.2 12.75,23.02 4.51,23.02 | U4.5 19.95,24.79 20.92,25.76 v20.92,26.37
  Bottom 0.508: v14.58,30.93 12.59,28.94 9.56,28.94 J4.3
B+1  (via drill 0.35)
  Top 0.254: v27.07,26.61 28.09,26.61 28.66,26.04 R4.2
  Bottom 0.203: J4.2 6.78,29.72 6.78,26.91 8.37,25.32
  Bottom 0.254: v27.07,26.61 24.56,24.1 21.51,24.1 20.29,25.32 8.37,25.32
B+2
  Top 0.254: R11.2 39.47,18.82 J7.2
B-1  (via drill 0.35)
  Top 0.254: v22.55,20.98 U4.9
  Top 0.406: U4.9 24.67,21 27.59,21 C11.1
  Bottom 0.203: 7.29,24.5 5.87,25.93 5.87,28.63 J4.1
  Bottom 0.254: 7.29,24.5 19.02,24.5 v22.55,20.98
B-2  (via drill 0.41)
  Top 0.203: v26.91,19.44 26.97,19.5 30.3,19.5 31.3,20.5 31.3,21.5 31.7,21.9 33.15,21.9 34.2,20.85
  Top 0.254: C18.1 34.2,20.85 39.5,20.85 J7.1 | U7.9 21.32,17.38 v21.3,17.4
  Bottom 0.254: v21.3,17.4 23.32,19.41 26.88,19.41 v26.91,19.44
D2  (via drill 0.41)
  Top 0.254: R6.1 42.44,35.9 v42.44,35.87 | v26.36,42.88 26.29,42.95 26.29,47.32 v26.19,47.42 | v28.85,47.86 28.85,48.56 31.14,50.85 U2.2
  Top 0.305: v28.85,47.86 29.65,47.06 U1.32
  Bottom 0.254: v42.44,35.87 39.37,38.94 36.37,38.94 34.55,40.77 34.55,42.7 33.55,43.69 27.18,43.69 v26.36,42.88 | v26.19,47.42 28.41,47.42 v28.85,47.86
D4  (via drill 0.35)
  Top 0.203: U1.2 29.39,43.11 29.86,42.64 29.86,40.46 v29.74,40.34
  Bottom 0.203: v29.74,40.34 29.13,40.34 27.89,39.1
  Bottom 0.305: v27.89,35.03 27.89,39.1
D5
  Top 0.203: 22.46,30.34 21.8,31 21.8,32.4 22.8,33.4 24.7,33.4 25.6,34.3 29,34.3 29.65,34.95 U1.9
  Top 0.254: U4.11 23.88,23.52 22.68,24.72 | 22.68,24.72 22.46,24.94 22.46,30.34 | 22.68,24.72 22.68,23.74 21.51,22.57 21.51,19.21 19.9,17.6 19.9,16 18.6,14.7 18.6,13.7 19.22,13.08 U7.11
D6
  Top 0.203: 22.93,29.93 22.93,30.87 22.5,31.3 22.5,32.1 23.2,32.8 24.88,32.8 25.98,33.9 29.8,33.9 30.45,34.55 U1.10
  Top 0.254: 22.93,29.93 22.93,25.52 23.67,24.79 U4.12
D7  (via drill 0.35, 0.41)
  Top 0.203: U1.11 31.25,34.35 30.2,33.3 29.4,33.3 v29.4,33.19
  Top 0.254: v19.48,31.97 19.96,31.97 21.95,29.98 21.95,24.03 20.8,22.88 20.8,19.6 19.1,17.9 19.1,16.4 17.9,15.2 17.9,13.1 19.19,11.81 U7.12
  Bottom 0.203: v29.4,33.19 20.69,33.19 v19.48,31.97
D13  (via drill 0.35)
  Top 0.203: v28.75,35.87 28.6,35.71 27.61,35.71 26.8,34.9 25.6,34.9 24.9,34.2 23.3,34.2 22.6,34.9 22.6,36.14 L2.1
  Top 0.254: U1.14 33.66,38.56 33.04,39.18 v30.46,39.18
  Bottom 0.305: v28.75,35.87 28.75,37.47 v30.46,39.18
DI  (via drill 0.35)
  Top 0.203: D2.C 15.46,60.47 U5.4 16.16,59.78 16.16,58.3 U9.10
  Top 0.254: R5.2 8.75,59.35 v9.3,59.9 | v15.9,56.7 16.16,56.96 16.16,58.3
  Bottom 0.254: v9.3,59.9 14.4,59.9 15.6,58.7 15.6,57 v15.9,56.7
E+1
  Top 0.406: R1.2 14.84,27.68 16.23,27.68 16.56,27.35 18.77,27.35 U4.3
  Top 0.508: 14.84,27.68 13.6,28.93 C8.1 13.6,32.98 | 13.6,32.98 Q1.3 | J4.4 10.66,35.92 13.6,32.98
  Top 0.61: R1.2 5.93,26.44 J3.4
E+2  (via drill 0.41)
  Top 0.254: U7.3 26.38,9.27 v25.11,8
  Top 0.61: Q2.3 33.63,3.99 C5.1 33.63,7.57 R8.2 35.17,7.59 39.24,3.53 J6.4 40.45,3.53 41.88,4.95 41.88,13.2 J7.4
  Bottom 0.254: v25.11,8 29.59,3.53 J6.4
GND  (via drill 0.35, 0.41)
  Top 0.203: Y1.2 23.39,36.7 23.2,36.9 23.2,39.47 C1.2 23.66,41.68 C2.2 | U1.5 28.96,40.71 29.23,40.98 29.23,41.88 29.06,42.05 28.48,42.05 U1.3 27.49,42.31 27.1,42.7 27.1,44.3 27.4,44.6 28.91,44.6 29.23,44.28 29.23,44.17 30.41,42.98 | 32.18,40.52 31.99,40.52 31.51,40.05 30.97,40.05 30.41,40.6 30.41,42.98 | 32.36,50.1 32.36,48.54 34.53,46.37 35.62,46.37 35.78,46.21 35.78,44.5 34.68,43.4 34.68,41.09 34.12,40.52 | 30.41,42.98 30.41,43.2 28.14,45.48 28.14,50.09 U2.1 29.82,51.77 32.2,51.77 32.36,51.6 32.36,50.1 | C3.2 41.31,39.19 C4.2 | C20.- 35.1,64.14 40.74,69.77 40.74,72.29 39.93,73.1 37.57,73.1 36.26,71.79 36.26,71.29 35.51,70.54 34.02,70.54 J1.1 31.29,71.42 29.63,69.76 22.95,69.76 19.58,73.13 16.74,73.13 15.53,71.92 15.53,70.82 15.18,70.47 14.04,70.47 12.96,71.55 J9.1 | U9.7 20.46,54.55 U5.5 | C16.2 32.35,50.09 32.36,50.1 | v32.13,39.91 32.15,39.9 32.15,39.89 v32.13,39.91 | 32.18,40.52 32.18,39.96 v32.13,39.91 | 32.18,40.52 34.12,40.52 | 34.12,40.52 34.62,40.52 35.61,41.51 U1.21 | C21.2 13.28,47 12.61,47.67 10.77,47.67 8.4,45.3 7.2,45.3 | 11.3,39.9 SW1.D | LED1.C 14.5,37.1 | 14.5,37.1 15.6,36 18.4,36 18.65,36.25 LED2.C 20.71,35.15 21.62,35.15 | 3.44,49.06 1.2,46.82 1.2,40.8 2.1,39.9 SW1.C SW1.D | SW1.D 11.1,36.6 12.1,35.6 13.9,35.6 14.5,36.2 14.5,37.1
  Top 0.254: C19.2 19.44,5.23 19.35,5.23 18.87,5.71 18.87,7.24 19.63,8 U7.15 U7.14 19.91,9.27 v19.15,10.03 | 21.62,35.15 v21.62,35.12 | v26.16,37.13 25.73,36.7 Y1.2 | U1.21 36.76,41.58 38,41.58 38.38,41.96 38.38,42.98 39.12,43.72 40.69,43.72 41.31,43.1 C3.2 | C7.2 7.04,53.34 7.02,53.36 3.44,49.78 3.44,49.06 7.2,45.3 | C15.2 30.26,56.64 27.98,56.64 26.92,55.58 U3.1 26.92,56.51 26.08,57.35 26.08,58.68 27.3,59.9 | J9.1 12.41,68.94 C13.2 16.04,65.31 16.04,65.04 16.23,64.85 16.28,64.85 16.79,64.85 17.5,64.14 17.5,62.83 19.91,60.42 U5.5 | C14.2 27.91,60.31 27.5,59.9 | SV1.6 27.39,28.18 v26.97,28.59
  Top 0.305: Z1.3 26.55,62.05 27.2,62.7 27.2,63.3 26.3,64.2 26.3,65.2 27,65.9 28.6,65.9 29.4,65.1 29.4,61.8 27.5,59.9 27.3,59.9 22.3,59.9 21.78,60.42 U5.5
  Top 0.508: U4.14 U4.15 v26.97,28.59 | C12.2 26.58,31.01 23.85,31.01 v23.36,31.49 | C20.- 31.79,60.31 C14.2
  Top 0.61: U2.1 28.26,51.5 26.3,51.5 25.2,52.6 25.2,53.57 U3.1
  Bottom 0.203: v26.16,37.13 26.16,35.28 27.38,34.06 29.42,34.06 32.15,36.79 32.13,36.81 v32.13,39.91
  Bottom 0.254: v19.15,10.03 17.08,12.1 17.08,17.12 19.92,19.96 23.79,19.96 28.13,24.3 28.13,27.44 v26.98,28.59 v26.97,28.59 26.26,28.59 24.64,30.21 | v26.16,37.13 26.18,37.11 26.18,36.65 25.59,36.06 22.56,36.06 v21.62,35.12 21.23,35.12 18.64,32.53 18.64,29.28 19.72,28.2 22.63,28.2 24.64,30.21 | v23.36,31.49 24.64,30.21
  pour Top: 1,39 15,39 15,35 53,35 53,78 -2,78 -2,39
  pour Bottom: -3,-2 56,-2 56,82 -3,82
GNDA  (via drill 0.41)
  Top 0.203: 31.21,5.41 31,5.62 31,7 30,8 31.65,9.65 R9.1
  Top 0.254: v32.48,4.26 31.88,4.86 C5.2 31.21,5.41 | U7.5 30.87,11.81 31.41,11.27 32.97,11.27 C6.2 33.81,11.55 J6.3
  Bottom 0.254: v32.48,4.26 38.57,4.26 J6.3
  Bottom 0.61: J7.3 41.37,15.7 41.37,7.06 J6.3
MISO
  Top 0.203: 36.93,34.04 35.25,35.72 U1.16
  Top 0.254: 36.93,34.04 37,33.97 37.68,33.97 38.62,33.03 SV1.1
MOSI
  Top 0.254: SV1.4 34.79,29.48 34.79,33.71 34.45,34.05 U1.15
N$1
  Top 0.305: F2.1 27.9,62.1 26.89,61.09 25.8,61.09 | 25.8,61.09 Z1.1 | U5.6 21.41,61.69 22.2,60.9 25.61,60.9 25.8,61.09
N$2
  Top 0.406: U4.2 18.21,28.59 15.93,30.87 Q1.1
N$3
  Top 0.203: RN2.7 16.98,43.88 15.8,42.7 15.8,38.8 15.4,38.4 12.7,38.4 12.37,38.07 LED1.A
N$4
  Top 0.406: U4.6 17.17,23.52 15.85,22.19 C9.1
N$5
  Top 0.406: U4.4 15.68,26.05 R1.1 15.3,26 R2.2
N$6
  Top 0.254: Q2.1 30.06,6.61 28.67,8 U7.2
N$7
  Top 0.406: U4.8 17.93,20.11 C10.2 R3.1
N$8
  Top 0.406: U4.10 24.67,22.27 26.71,22.27 C11.2 26.91,25.04 R4.1
N$9
  Top 0.254: R8.1 31.96,7.93 R9.2 32.54,10.79 27.42,10.79 U7.4
N$10
  Top 0.254: U1.7 28.2,39.12 27.48,39.12 26.26,37.91 Y1.1
N$11
  Top 0.254: Y1.3 25.57,35.51 28.21,38.14 U1.8
N$12
  Top 0.203: RN2.8 18.91,43.09 18.62,43.38 17.28,43.38 16.8,42.9 16.8,39.27 16.55,39.01 LED2.A
N$13
  Top 0.254: C6.1 31.09,13.08 U7.6
N$14
  Top 0.254: R10.1 31.98,14.53 C17.2 30.82,15.62 U7.8
N$15  (via drill 0.41)
  Top 0.254: U7.10 v19.52,14.35 | v26.65,17.39 30.55,17.39 R11.1 32.42,19.25 C18.2
  Bottom 0.254: v26.65,17.39 24.14,17.39 24.13,17.39 22.56,17.39 v19.52,14.35
N$16
  Top 0.203: 22.4,62.96 22.66,62.96 23.4,63.7 23.4,64.74 23.34,64.8
  Top 0.305: F1.1 23.34,64.8 | U5.7 22.4,62.96 25.51,62.96 Z1.2
N$17
  Top 0.61: J1.2 35.14,72.06 34.32,72.88 30.07,72.88 F4.2
N$18
  Top 0.61: F3.2 40.7,55.62 D1.1
N$19  (via drill 0.41)
  Top 0.203: L1.2 19.94,39.34 20.9,40.3 v20.9,40.9 | v22.2,43.7 21.9,44 21.13,44 RN2.2
  Bottom 0.203: v20.9,40.9 22.2,42.2 v22.2,43.7
N$20
  Top 0.203: L2.2 21.7,42.4 RN2.1
NREDE
  Top 0.203: U9.12 13.6,58.22 13.6,59.6 13.5,59.7 13.5,60.9 14.3,61.7 U5.3 U5.2
RECTIFIED
  Top 0.406: C20.+ 34.77,58.56 C14.1 28.74,58.56 U3.3
  Top 0.508: C20.+ 35.34,58 35.34,55.98 40.38,50.94 D1.2
RESET  (via drill 0.35)
  Top 0.203: v24.5,47.08 24.5,47 24.27,47.23 R7.1 21.66,47.16 21.66,47.84 21.34,48.16 19.29,48.16 18.97,47.84 18.97,46.61 16.45,44.09 11.41,44.09 11.25,44.25 SW1.B SW1.A | v32.5,47 32.5,46.6 32.05,46.15 U1.29
  Top 0.254: v32.87,42.83 32.05,43.64 U1.29 | C21.1 11.43,46.2 11.43,44.73 SW1.B
  Bottom 0.203: SV1.5 33.54,38.75 32.87,39.42 | v24.5,47.08 25.08,46.5 32,46.5 v32.5,47
  Bottom 0.254: v32.87,42.83 32.87,39.42
RO
  Top 0.203: U9.9 17.43,59.87 16.7,60.6 16.7,63.4 15.87,64.23 U5.1
RS485-A
  Top 0.254: 26.43,66.83 25.68,66.83 24.68,65.83 21.92,65.83 21.22,66.53 21.22,69.4 20.65,69.97 19.99,69.97 J9.4 | J1.4 39.14,70.54 37.2,68.6 30.84,68.6 29.07,66.83
  Top 0.305: 29.07,66.83 F2.2 26.43,66.83
RS485-B
  Top 0.254: 25.6,68.4 26.4,69.2 35.9,69.2 37.14,70.44 J1.3 | F1.2 23.13,68.81 19.34,72.6 17.2,72.6 16.41,71.81 J9.3
  Top 0.305: F1.2 24,66.8 25.6,68.4
RX  (via drill 0.35)
  Top 0.254: v30.38,48.49 31.25,47.62 U1.30 | U9.4 14.93,52.74 14.93,51.29 16.36,49.86 23.91,49.86 v25.2,48.57
  Bottom 0.254: v30.38,48.49 30,48.87 25.5,48.87 v25.2,48.57
SCK
  Top 0.203: U1.17 38.3,36.7 38.3,34.6
  Top 0.254: 38.3,34.6 38.62,34.28 39.57,34.28 40.08,33.77 40.08,29.98 39.7,29.6 37.21,29.6 SV1.3
SCL  (via drill 0.35)
  Top 0.254: U1.28 32.85,44.19 33.71,43.33 33.71,41.96 33.5,41.76 v31.39,41.76 | RN2.4 23.61,45.48 v24.2,44.9
  Bottom 0.254: v24.2,44.9 24.6,44.5 24.6,42.5 25.2,41.9 28.86,41.9 28.88,41.92 29.39,41.92 29.46,41.84 31.31,41.84 v31.39,41.76
SDA  (via drill 0.35)
  Top 0.203: RN2.3 23.41,44.69 23.86,44.23 v23.86,43.8 | v31.24,40.76 31.39,40.91 33.41,40.91 34.3,41.8 34.3,43.7 33.65,44.35 U1.27
  Bottom 0.203: v23.86,43.8 24,43.8 24,42.1 24.8,41.3 30.1,41.3 30.64,40.76 v31.24,40.76
TX  (via drill 0.35)
  Top 0.203: R12.1 9.53,51.23 U9.1 | 11.08,50.31 11.08,50.19 12.73,48.54 v23.45,48.54
  Top 0.254: v30.42,47.32 30.45,47.29 U1.31 | 11.08,50.31 U9.1
  Bottom 0.203: 30.68,49.19 30.59,49.28 28.18,49.28 24.19,49.28 v23.45,48.54
  Bottom 0.254: v30.42,47.32 30.7,47.32 31.11,47.73 31.11,48.39 31.09,48.41 31.09,48.78 30.68,49.19
VIN
  Top 0.61: J9.2 14.43,71.57 14.43,72.88 15.4,73.85 21.54,73.85 F4.1 26.88,74.47 40.11,74.47 41.76,72.82 41.76,67.72 40.61,66.57 40.61,64.78 F3.1

### Text on the board
tPlace: 3.5 to 13.2V | 3.5 to 13.2V | PWR IN / RS485 IN | PWR OUT / RS485 OUT | GND | VIN | B | A | + | GND | - | VOUT | B | A | WWW.CEAZA.CL | RESET | L1 | LOAD CELL B1 | ICSP | CEAZA SCALE V1.3.1 | LOAD CELL A1 | GND | +3V3 | LOAD CELL B2 | LOAD CELL A2 | A.G. 2025
bPlace: Instruments & Embedded Systems
tNames: D1
bNames: BOARD MODEL / CEAZA LOAD V1.1 / / DESIGN CEAZA / A.G. F.V. / / WWW.CEAZA.CL / / MAR 2025